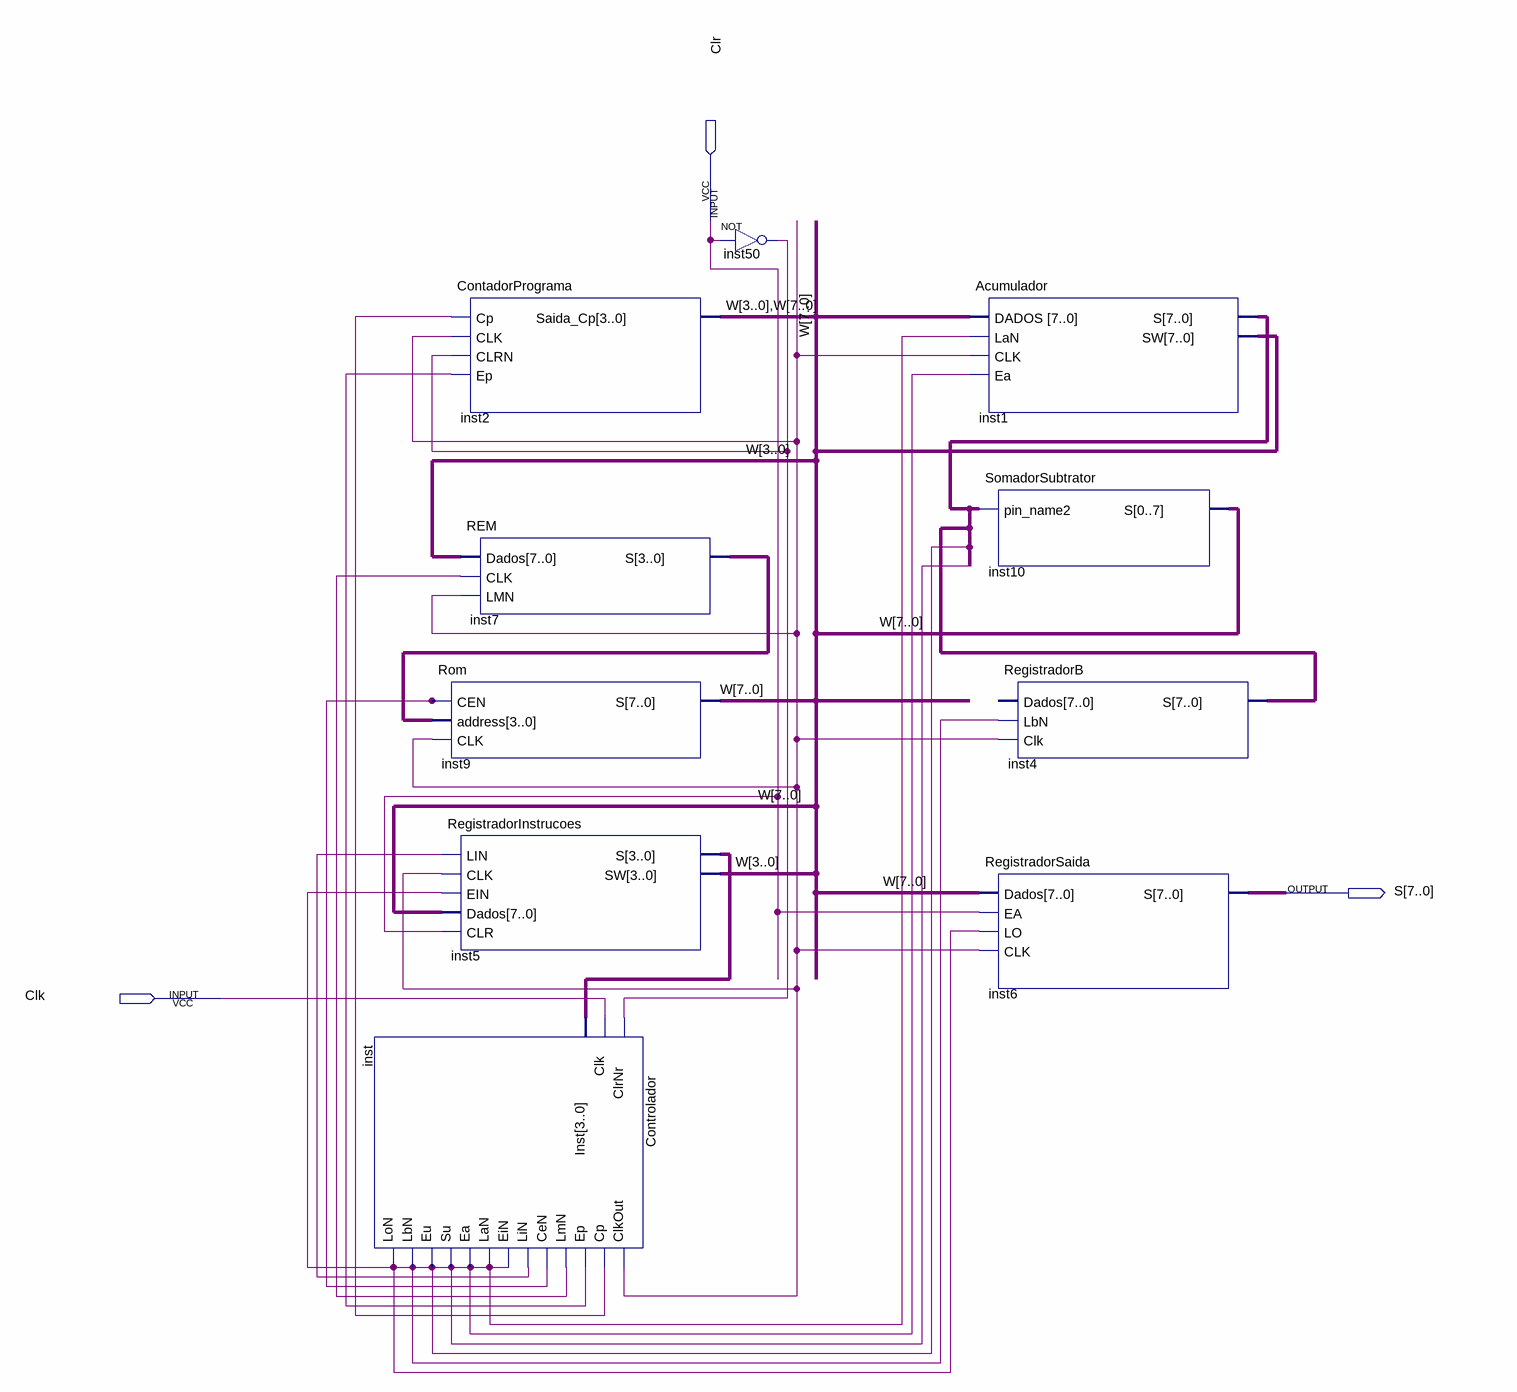
[diagram p0: schematic sheet]
// Quartus schematic Microprocessador.bdf as structural Verilog: 10 symbols, 3 pins
module Microprocessador (
  input  Clr,
  input  Clk,
  output [7:0] S
);

  wire inst50_out, inst_cen, inst_clkout, inst_cp, inst_ein, inst_ep, inst_lin, inst_lmn;
  wire [3:0] inst5_s, inst7_s;
  wire [7:0] inst1_s, W;

  Controlador inst (
    .ClrNr(inst50_out), .Clk(Clk), .Inst(inst5_s), .ClkOut(inst_clkout), .Cp(inst_cp), .Ep(inst_ep),
    .LmN(inst_lmn), .CeN(inst_cen), .LiN(inst_lin), .EiN(inst_ein), .LaN(inst_ein), .Ea(inst_ein),
    .Su(inst_ein), .Eu(inst_ein), .LbN(inst_ein), .LoN(inst_ein));
  Rom inst9 (.CEN(inst_cen), .address(inst7_s), .CLK(inst_clkout), .S(W));
  RegistradorInstrucoes inst5 (
    .LIN(inst_lin), .CLK(inst_clkout), .EIN(inst_ein), .Dados(W), .CLR(Clr), .S(inst5_s), .SW(W[3:0]));
  ContadorPrograma inst2 (.Cp(inst_cp), .CLK(inst_clkout), .CLRN(inst50_out), .Ep(inst_ep), .Saida_Cp({W[3:0], W}));
  REM inst7 (.Dados(W[3:0]), .CLK(inst_lmn), .LMN(inst_clkout), .S(inst7_s));
  not inst50 (inst50_out, Clr);
  Acumulador inst1 (
    .DADOS({W[3:0], W}), .LaN(inst_ein), .CLK(inst_clkout), .Ea(inst_ein), .S(inst1_s), .SW({W[3:0], W}));
  SomadorSubtrator inst10 (.pin_name2(inst1_s), .S(W));
  RegistradorSaida inst6 (.Dados(W), .EA(Clr), .LO(inst_ein), .CLK(inst_clkout), .S(S));
  RegistradorB inst4 (.LbN(inst_ein), .Clk(inst_clkout), .S(inst1_s));  // open: Dados
endmodule
